# EAGLE design pcb-pick-plaz-feeder-wiring (EAGLE 9.6.2)
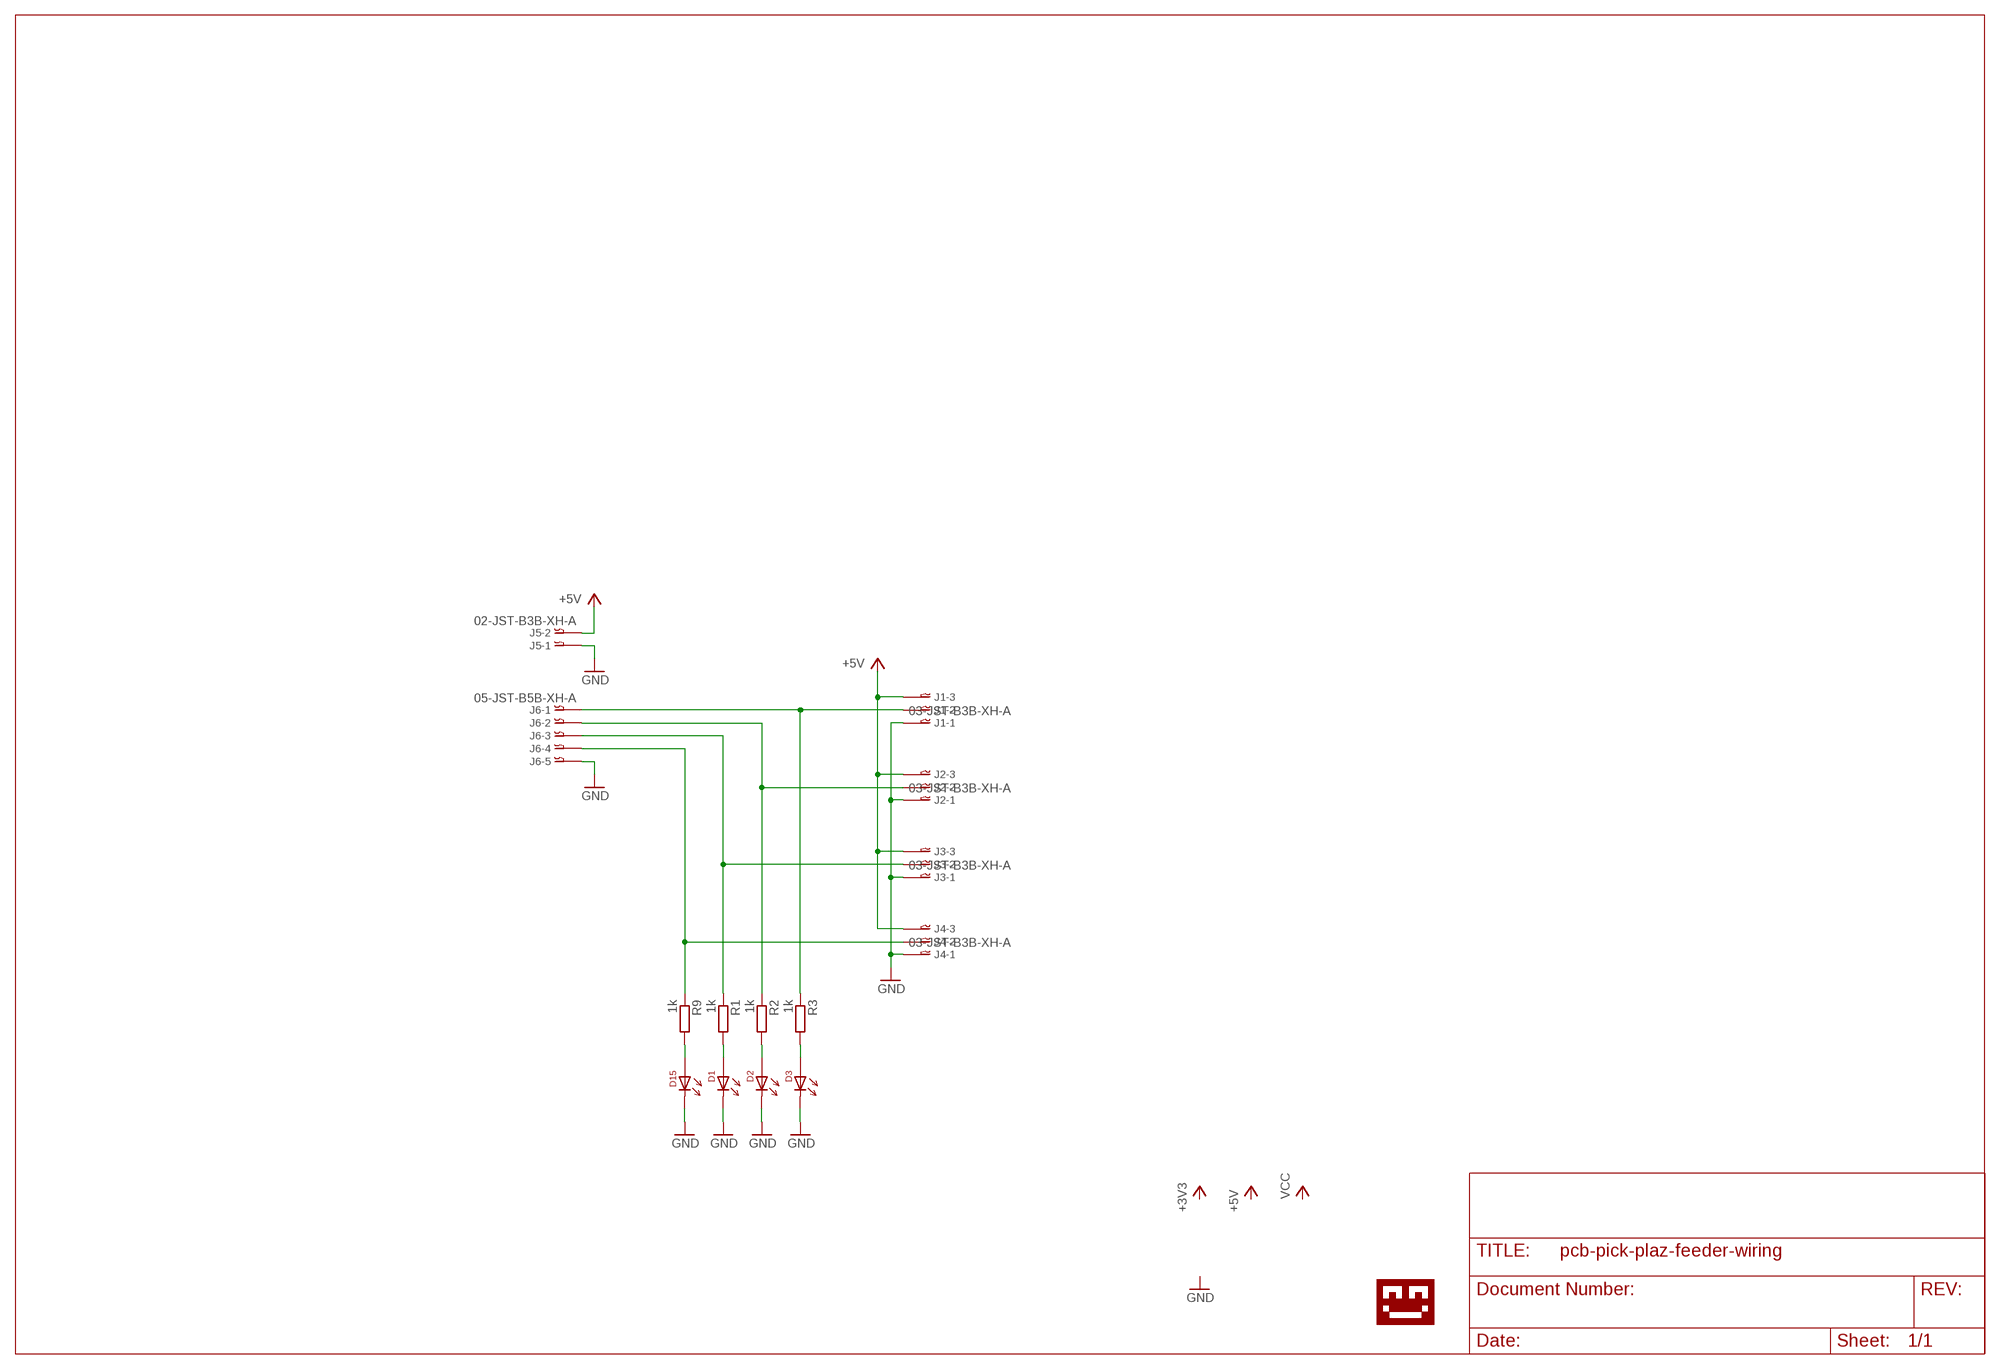
[diagram p0: schematic, sheet 1]

## Parts
D1  LED-0805  [0805-DOT]
D2  LED-0805  [0805-DOT]
D3  LED-0805  [0805-DOT]
D15  LED-0805  [0805-DOT]
J1  03-JST-B3B-XH-A  [B3B-XH]
J2  03-JST-B3B-XH-A  [B3B-XH]
J3  03-JST-B3B-XH-A  [B3B-XH]
J4  03-JST-B3B-XH-A  [B3B-XH]
J5  02-JST-B3B-XH-A  [B2B-XH]
J6  05-JST-B5B-XH-A  [B5B-XH]
R1  1k  RESISTOR0603_RES  [0603-RES]
R2  1k  RESISTOR0603_RES  [0603-RES]
R3  1k  RESISTOR0603_RES  [0603-RES]
R9  1k  RESISTOR0603_RES  [0603-RES]
U$1  LOGO-TOBENG-1MM-FINISH  [TOBENG-1MM-FINISH]

## Nets
+5V: J1.P$3 J2.P$3 J3.P$3 J4.P$3 J5.P$2
GND: D1.2 D2.2 D3.2 D15.2 J1.P$1 J2.P$1 J3.P$1 J4.P$1 J5.P$1 J6.P$5
N$1: J3.P$2 J6.P$3 R1.1
N$2: J4.P$2 J6.P$4 R9.1
N$3: D1.1 R1.2
N$4: J2.P$2 J6.P$2 R2.1
N$5: J1.P$2 J6.P$1 R3.1
N$6: D15.1 R9.2
N$7: D2.1 R2.2
N$8: D3.1 R3.2

## Library data of the parts
D1-D3 D15 = ftobler:LED
J1-J4 = bt_con-jst-xh:03-JST: JST CONNECTOR
J5 = bt_con-jst-xh:02-JST: JST CONNECTOR
J6 = bt_con-jst-xh:05-JST: JST CONNECTOR
R1-R3 R9 = passives:RESISTOR: Resistor Basic schematic elements and footprints for 0201, 0402, 0603, 1206, and PTH resistors.
U$1 = ftobler:LOGO

## Board
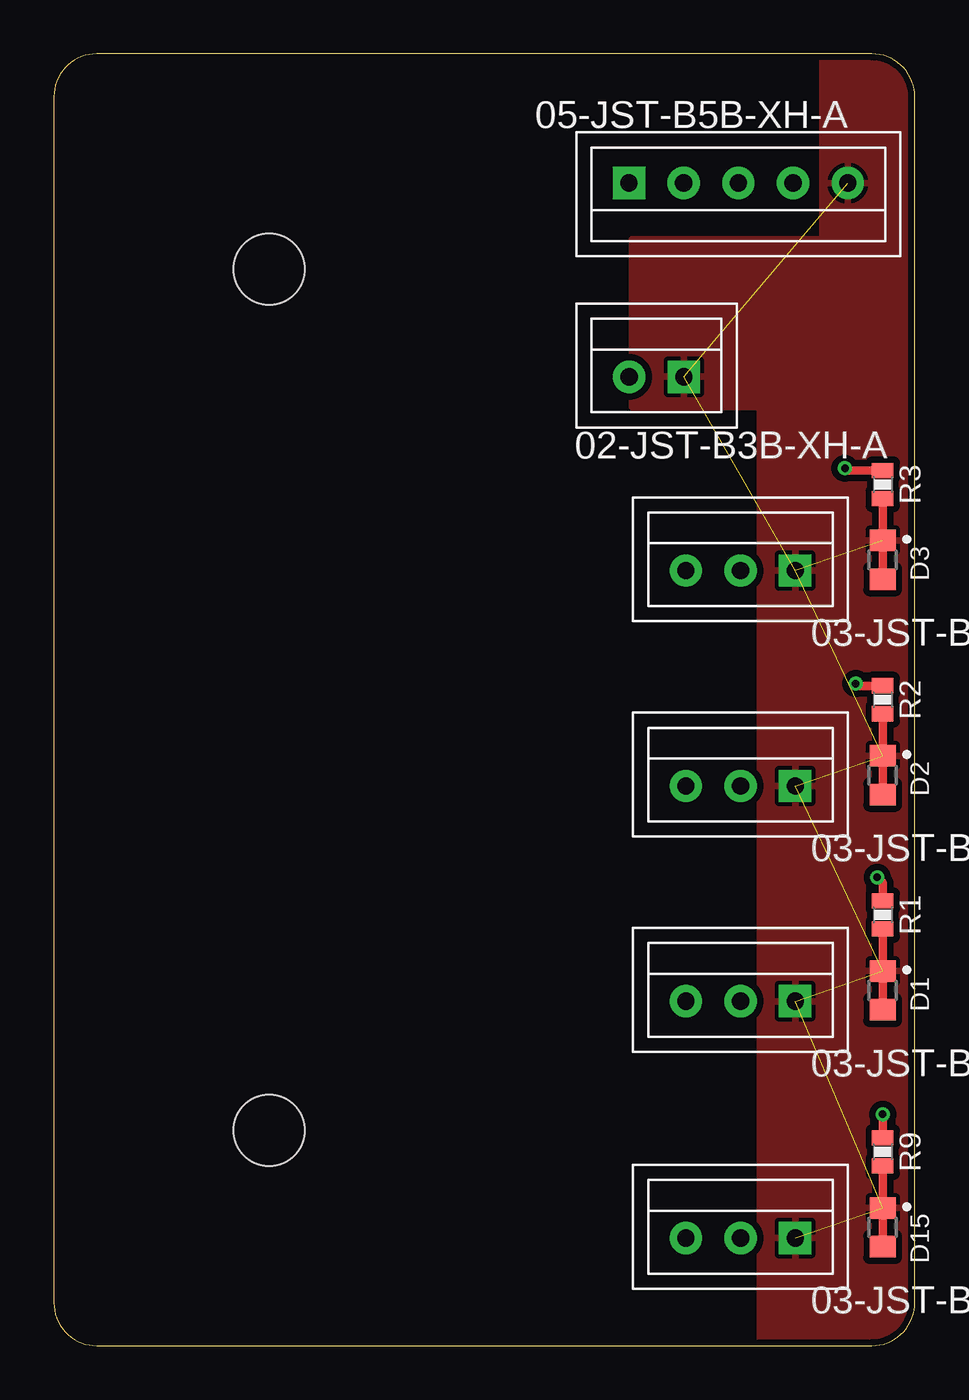
[diagram p1: board, top side]
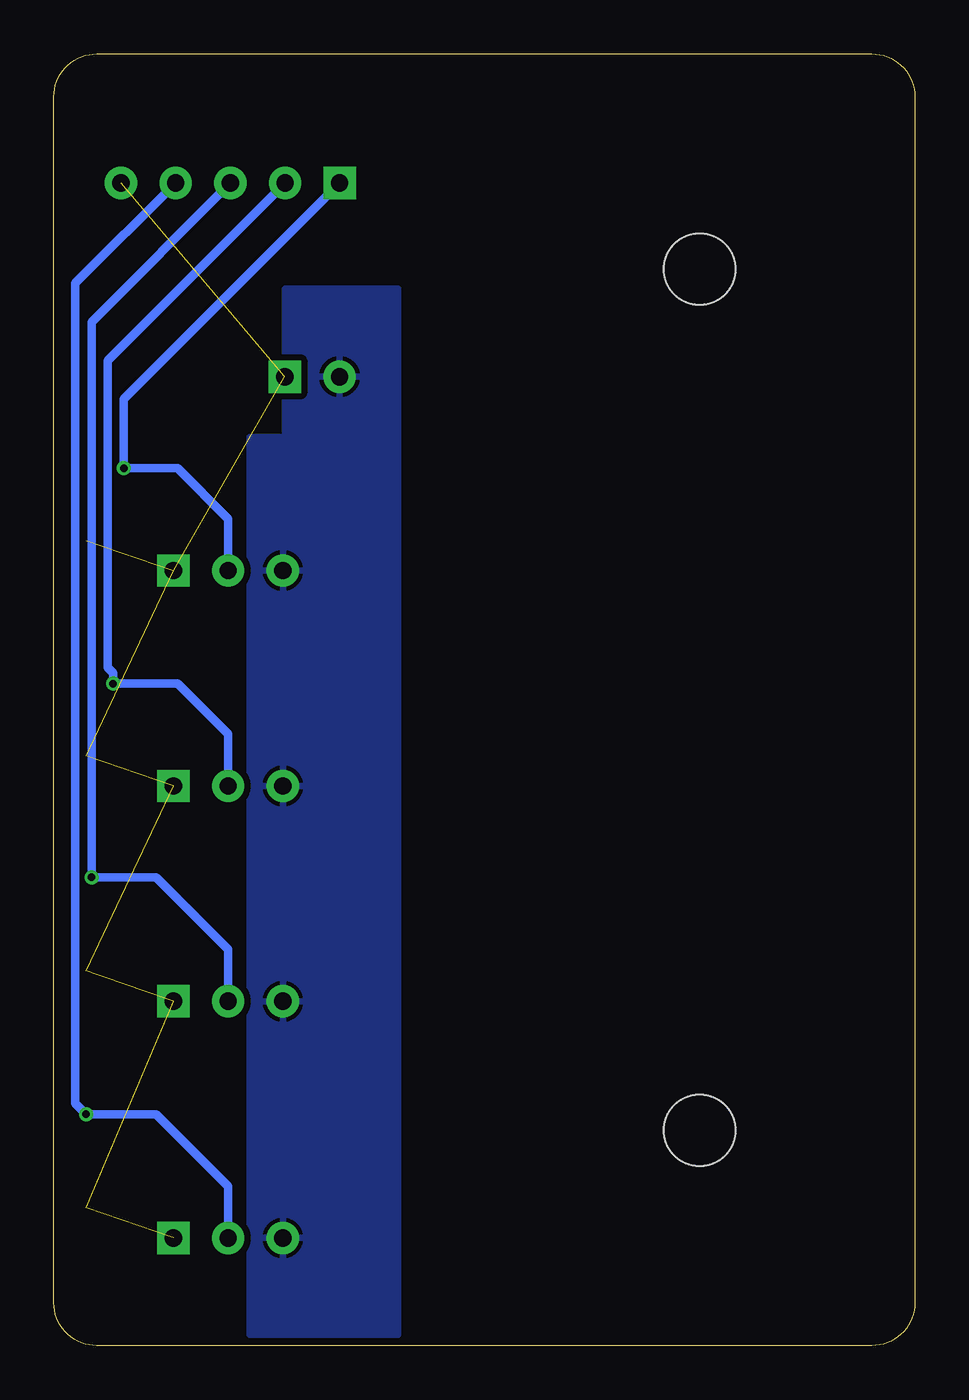
[diagram p2: board, bottom side, seen from below]

Size 40 x 60 mm. Coordinates in mm from the lower left corner, seen from the top.
Outline: 0,58 0,2 arc90 2,0 38,0 arc90 40,2 40,58 arc90 38,60 2,60 arc90 0,58
Copper layers (1*16): Top 0.035mm / dielectric 1.5mm / Bottom 0.035mm
Design rules "default *": minimum track width 0.2mm, minimum drill 0.3mm, track to track 0.2mm, track to pad 0.2mm, pad to pad 0.2mm, via to via 0.2mm, smd to smd 0.2mm, copper to edge 0.3mm, drill to drill 10mil, minimum pad ring 0.15mm, minimum via ring 0.15mm, stop-mask expansion 0.05mm, vias tented up to drill 0.35mm, thermal gap 0.2mm
Holes 3.3 mm at 10,50 10,10

### Footprints (pad centres in the part's own frame; a part is rotated, then mirrored left to right if it is on the bottom)
0805-DOT = smd 1 x 1.2: 1 0.9,0; 2 -0.9,0
B3B-XH = drill 0.8 pad 1.5 square: P$1 2.54,0 | drill 0.8 pad 1.5: P$2 0,0; P$3 -2.54,0
B2B-XH = drill 0.8 pad 1.5 square: P$1 1.27,0 | drill 0.8 pad 1.5: P$2 -1.27,0
B5B-XH = drill 0.8 pad 1.5 square: P$1 5.08,0 | drill 0.8 pad 1.5: P$2 2.54,0; P$3 0,0; P$4 -2.54,0; P$5 -5.08,0
0603-RES = smd 0.7 x 1: 1 -0.65,0; 2 0.65,0

### Placement (x,y rotation side)
D1  38.5,16.5 270 top
D2  38.5,26.5 270 top
D3  38.5,36.5 270 top
D15  38.5,5.5 270 top
J1  31.9,36 0 top
J2  31.9,26 0 top
J3  31.9,16 0 top
J4  31.9,5 0 top
J5  28,45 0 top
J6  31.8,54 180 top
R1  38.5,20 270 top
R2  38.5,30 270 top
R3  38.5,40 270 top
R9  38.5,9 270 top
U$1  12.5,27.65 90 top

### Tracks (layer width: path | path; a pad name or v marks a point on that pad's centre or on a via)
+5V
  pour Bottom (isolate 0.3, rank 2): 29.25,49.1 24,49.1 24,0.5 30.9,0.5 30.9,42.2 29.25,42.2
GND  (9 unrouted)
  pour Top (isolate 0.3): 26.85,51.4 26.85,43.6 32.8,43.6 32.8,-1.5 42,-1.5 42,61.4 35.7,61.4 35.7,51.4
N$1  (via drill 0.35)
  Top 0.4: R1.1 38.5,21.5 v38.25,21.75
  Bottom 0.4: J6.P$3 38.25,47.55 v38.25,21.75 35.25,21.75 31.9,18.4 J3.P$2
N$2  (via drill 0.35)
  Top 0.4: v38.5,10.75 R9.1
  Bottom 0.4: J6.P$4 39,49.34 39,11.25 v38.5,10.75 35.25,10.75 31.9,7.4 J4.P$2
N$3
  Top 0.4: R1.2 D1.1
N$4  (via drill 0.35)
  Top 0.4: R2.1 37.35,30.65 v37.25,30.75
  Bottom 0.4: J2.P$2 31.9,28.4 34.25,30.75 v37.25,30.75 37.25,31.25 37.5,31.5 37.5,45.76 J6.P$2
N$5  (via drill 0.35)
  Top 0.4: v36.75,40.75 36.85,40.65 R3.1
  Bottom 0.4: J6.P$1 36.75,43.97 v36.75,40.75 34.25,40.75 31.9,38.4 J1.P$2
N$6
  Top 0.4: R9.2 D15.1
N$7
  Top 0.4: R2.2 D2.1
N$8
  Top 0.4: R3.2 D3.1

### Text on the board
tFinish: pcb-pick-plaz-feeder-wiring v1 / by ftobler 2022